# Altium schematic sheet Relay_Control.SchDoc
size A; SheetNumber: 4; SheetTotal: 10
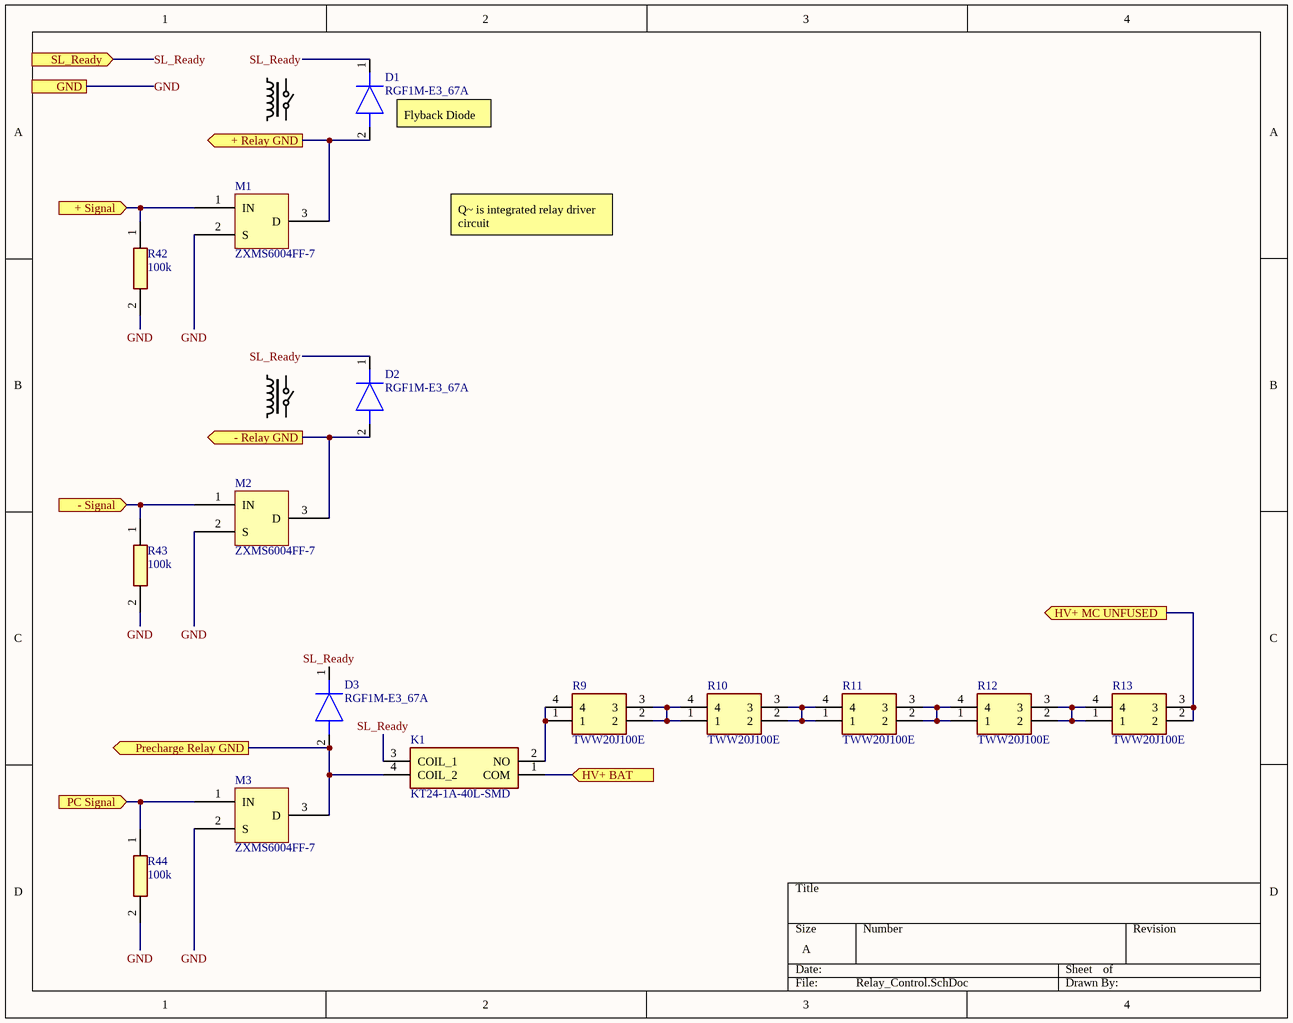
[diagram p0: Relay_Control.SchDoc]

## Parts
D1  RGF1M-E3_67A  [DIOM5426X300N]
D2  RGF1M-E3_67A  [DIOM5426X300N]
D3  RGF1M-E3_67A  [DIOM5426X300N]
K1  KT24-1A-40L-SMD  [KT241A40LSMD]
M1  ZXMS6004FF-7  [SOT95P240X100-3N]
M2  ZXMS6004FF-7  [SOT95P240X100-3N]
M3  ZXMS6004FF-7  [SOT95P240X100-3N]
R9  TWW20J100E  [TWW20J100E]
R10  TWW20J100E  [TWW20J100E]
R11  TWW20J100E  [TWW20J100E]
R12  TWW20J100E  [TWW20J100E]
R13  TWW20J100E  [TWW20J100E]
R42  100k  [RESC3216X65N]
R43  100k  [RESC3216X65N]
R44  100k  [RESC3216X65N]

## Ports
+ Relay GND (out), + Signal (in), - Relay GND (out), - Signal (in), GND, HV+ BAT (in), HV+ MC UNFUSED (out), PC Signal (in), Precharge Relay GND (out), SL_Ready (in)

## Nets
+ Relay GND: D1.2(A) M1.3(D) ; port + Relay GND
+ Signal: M1.1(IN) R42.1 ; port + Signal
- Relay GND: D2.2(A) M2.3(D) ; port - Relay GND
- Signal: M2.1(IN) R43.1 ; port - Signal
GND: M1.2(S) M2.2(S) M3.2(S) R42.2 R43.2 R44.2 ; port GND
HV+ BAT: K1.1(COM) ; port HV+ BAT
HV+ MC UNFUSED: R13.2 R13.3 ; port HV+ MC UNFUSED
PC Signal: M3.1(IN) R44.1 ; port PC Signal
Precharge Relay GND: D3.2(A) K1.4(COIL_2) M3.3(D) ; port Precharge Relay GND
SL_Ready: D1.1(K) D2.1(K) D3.1(K) K1.3(COIL_1) ; port SL_Ready
NetK1_2: K1.2(NO) R9.1 R9.4
NetR9_2: R9.2 R9.3 R10.1 R10.4
NetR10_2: R10.2 R10.3 R11.1 R11.4
NetR11_2: R11.2 R11.3 R12.1 R12.4
NetR12_2: R12.2 R12.3 R13.1 R13.4

## Notes on the sheet
- (near D1) Flyback Diode
- Q~ is integrated relay driver circuit

## Library data of the parts
D1-D3 = RGF1M-E3_67A: Diode; Manufacturer_Name: Vishay; Manufacturer_Part_Number: RGF1M-E3/67A; Datasheet Link: https://www.vishay.com/docs/88697/rgf1.pdf; Height: 3mm; Mouser Part Number: 625-RGF1M-E3; Mouser Price/Stock: https://www.mouser.co.uk/ProductDetail/Vishay-General-Semiconductor/RGF1M-E3-67A?qs=4xyK702%2F%252BQ1dl%252BTCdyIThg%3D%3D; Arrow Part Number: RGF1M-E3/67A; Arrow Price/Stock: https://www.arrow.com/en/products/rgf1m-e367a/vishay?region=nac
K1 = KT24-1A-40L-SMD: Relay or Contactor; Manufacturer_Name: Meder; Datasheet Link: https://www.mouser.de/datasheet/2/262/9024185401e-1633625.pdf; Height: 8.7mm; Manufacturer_Part_Number: KT24-1A-40L-SMD; Mouser Part Number: 876-KT24-1A-40L-SMD; Mouser Price/Stock: https://www.mouser.co.uk/ProductDetail/MEDER-electronic-Standex/KT24-1A-40L-SMD?qs=mUCnLpxNPte72XvEBELL9g%3D%3D
R9-R13 = TWW20J100E: Resistor; Manufacturer_Name: Ohmite; Datasheet Link: https://www.mouser.in/datasheet/2/303/res_tww_twm-1228653.pdf; Height: 46mm; Manufacturer_Part_Number: TWW20J100E; Mouser Part Number: 588-TWW20J100E; Mouser Price/Stock: https://www.mouser.co.uk/ProductDetail/Ohmite/TWW20J100E?qs=PzGy0jfpSMsE3rbWfgqD2A%3D%3D
R42-R44 = MCA1206ME1003BP500: Resistor; Manufacturer_Name: Vishay; Datasheet Link: https://www.vishay.com/docs/28700/mcx0x0xpre.pdf; Height: 0.65mm; Manufacturer_Part_Number: MCA1206ME1003BP500